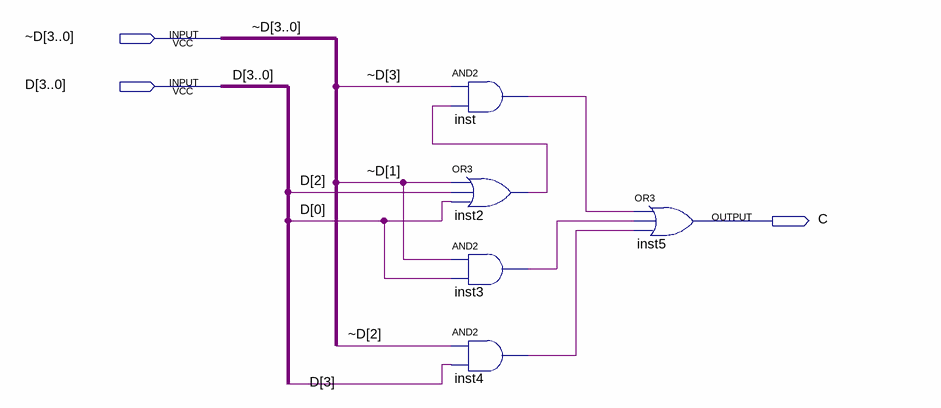
[diagram p0: schematic sheet]
// Quartus schematic SEG_C.bdf as structural Verilog: 5 symbols, 3 pins
module SEG_C (
  input  [3:0] \~D ,
  input  [3:0] D,
  output C
);

  wire inst2_out, inst3_out, inst4_out, inst_out;

  and inst (inst_out, \~D [3], inst2_out);
  or inst2 (inst2_out, \~D [1], D[2], D[0]);
  and inst3 (inst3_out, \~D [1], D[0]);
  and inst4 (inst4_out, \~D [2], D[3]);
  or inst5 (C, inst_out, inst3_out, inst4_out);
endmodule
